# Altium schematic sheet 06-USB PORTS.SchDoc
size 513 x 386 mm
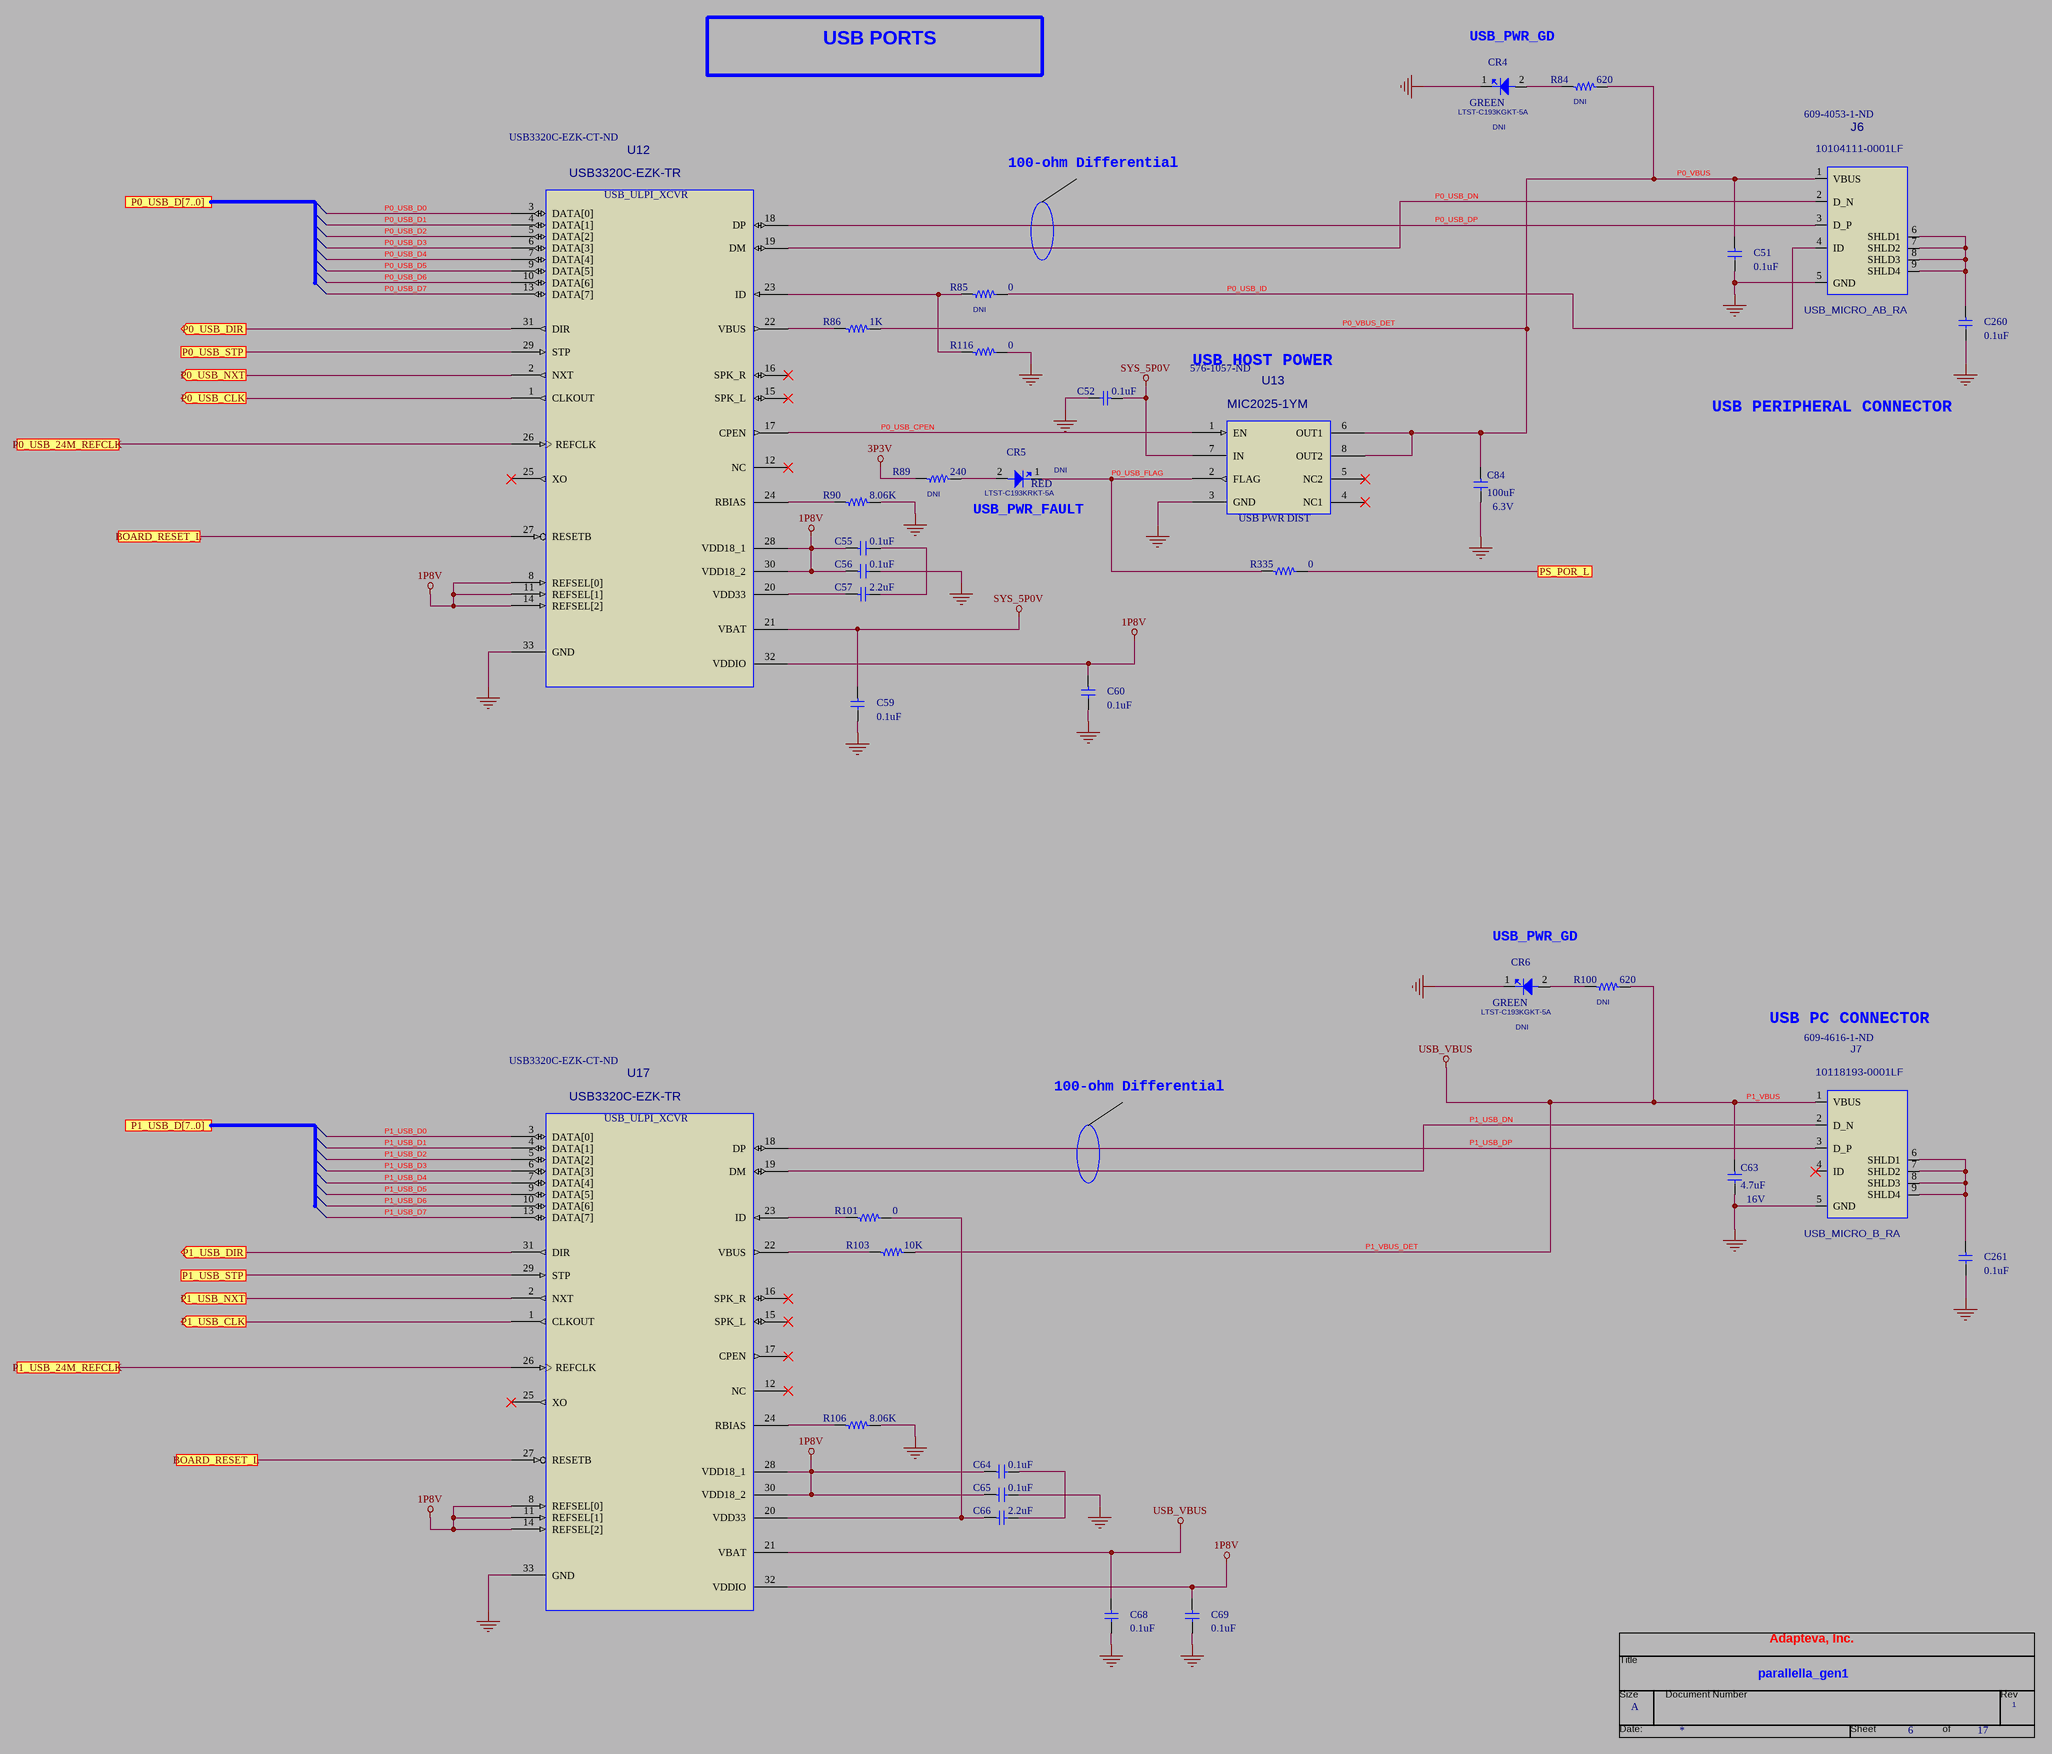
[diagram p0: 06-USB PORTS.SchDoc]

## Parts
*  RevCode: 1  Title: parallella_gen1  Page Size: A  Page Number: 6  Page Count: 17  OrgAddr1: Adapteva, Inc.  (hidden comment: TitleBlock0)  (graphical)
C51  0.1uF  [C0402]
C52  0.1uF  [C0402]
C55  0.1uF  [C0402]
C56  0.1uF  [C0402]
C57  2.2uF  [C0402]
C59  0.1uF  [C0402]
C60  0.1uF  [C0402]
C63  4.7uF  VOLTAGE: 16V  [C0603]
C64  0.1uF  [C0402]
C65  0.1uF  [C0402]
C66  2.2uF  [C0402]
C68  0.1uF  [C0402]
C69  0.1uF  [C0402]
C84  100uF  VOLTAGE: 6.3V  [C1210]
C260  0.1uF  [C0402]
C261  0.1uF  [C0402]
CR4  GREEN  Vendor PN: LTST-C193KGKT-5A  INSTALL: DNI  [LED_0603]
CR5  RED  Vendor PN: LTST-C193KRKT-5A  INSTALL: DNI  [LED_0603]
CR6  GREEN  Vendor PN: LTST-C193KGKT-5A  INSTALL: DNI  [LED_0603]
J6  USB_MICRO_AB_RA  MFG PART NO: 10104111-0001LF  Supplier Part Number 1: 609-4053-1-ND  [USB_MICRO5P_5X7X3P07MMH]
J7  USB_MICRO_B_RA  MFG PART NO: 10118193-0001LF  Supplier Part Number 1: 609-4616-1-ND  [USB_MICROB_5P05X7P86X3P1MM_RH]
R84  620  INSTALL: DNI  [R0402]
R85  0  INSTALL: DNI  [R0402]
R86  1K  [R0402]
R89  240  INSTALL: DNI  [R0402]
R90  8.06K  [R0402]
R100  620  INSTALL: DNI  [R0402]
R101  0  [R0402]
R103  10K  [R0402]
R106  8.06K  [R0402]
R116  0  [R0402]
R335  0  [R0402]
U12  USB_ULPI_XCVR  Vendor PN: USB3320C-EZK-TR  Supplier Part Number 1: USB3320C-EZK-CT-ND  [QFN32_5SQXP9H_P5MMP_3P45PAD]
U13  USB PWR DIST  Vendor PN: MIC2025-1YM  Supplier Part Number 1: 576-1057-ND  [SOIC8_33P94X4P93X1P63H_P65P]
U17  USB_ULPI_XCVR  Vendor PN: USB3320C-EZK-TR  Supplier Part Number 1: USB3320C-EZK-CT-ND  [QFN32_5SQXP9H_P5MMP_3P45PAD]

## Ports
BOARD_RESET_L, P0_USB_24M_REFCLK, P0_USB_CLK (out), P0_USB_D[7..0], P0_USB_DIR (out), P0_USB_NXT (out), P0_USB_STP, P1_USB_24M_REFCLK, P1_USB_CLK (out), P1_USB_D[7..0], P1_USB_DIR (out), P1_USB_NXT (out), P1_USB_STP, PS_POR_L

## Nets
1P8V: C55.1 C56.1 C60.1 C64.1 C65.1 C69.1 U12.8(REFSEL[0]) U12.11(REFSEL[1]) U12.14(REFSEL[2]) U12.28(VDD18_1) U12.30(VDD18_2) U12.32(VDDIO) U17.8(REFSEL[0]) U17.11(REFSEL[1]) U17.14(REFSEL[2]) U17.28(VDD18_1) U17.30(VDD18_2) U17.32(VDDIO)
3P3V: R89.1
GND: C51.2 C52.2 C56.2 C59.2 C60.2 C63.2 C65.2 C68.2 C69.2 C84.2 C260.2 C261.2 CR4.1(C) CR6.1(C) J6.5(GND) J7.5(GND) R90.2 R106.2 R116.2 U12.33(GND) U13.3(GND) U17.33(GND)
P1_VBUS: C63.1 C68.1 J7.1(VBUS) R100.2 R103.2 U17.21(VBAT)  [also labelled P1_VBUS_DET, USB_VBUS]
SYS_5P0V: C52.1 C59.1 U12.21(VBAT) U13.7(IN)
BOARD_RESET_L: U12.27(RESETB) U17.27(RESETB) ; port BOARD_RESET_L
P0_USB_24M_REFCLK: U12.26(REFCLK) ; port P0_USB_24M_REFCLK
P0_USB_CLK: U12.1(CLKOUT) ; port P0_USB_CLK
P0_USB_CPEN: U12.17(CPEN) U13.1(EN)
P0_USB_D0: U12.3(DATA[0])
P0_USB_D1: U12.4(DATA[1])
P0_USB_D2: U12.5(DATA[2])
P0_USB_D3: U12.6(DATA[3])
P0_USB_D4: U12.7(DATA[4])
P0_USB_D5: U12.9(DATA[5])
P0_USB_D6: U12.10(DATA[6])
P0_USB_D7: U12.13(DATA[7])
P0_USB_DIR: U12.31(DIR) ; port P0_USB_DIR
P0_USB_DN: J6.2(D_N) U12.19(DM)
P0_USB_DP: J6.3(D_P) U12.18(DP)
P0_USB_FLAG: CR5.1(C) R335.1 U13.2(FLAG)
P0_USB_ID: J6.4(ID) R85.2
P0_USB_NXT: U12.2(NXT) ; port P0_USB_NXT
P0_USB_STP: U12.29(STP) ; port P0_USB_STP
P0_VBUS: C51.1 C84.1 J6.1(VBUS) R84.2 R86.2 U13.6(OUT1) U13.8(OUT2)  [also labelled P0_VBUS_DET]
P1_USB_24M_REFCLK: U17.26(REFCLK) ; port P1_USB_24M_REFCLK
P1_USB_CLK: U17.1(CLKOUT) ; port P1_USB_CLK
P1_USB_D0: U17.3(DATA[0])
P1_USB_D1: U17.4(DATA[1])
P1_USB_D2: U17.5(DATA[2])
P1_USB_D3: U17.6(DATA[3])
P1_USB_D4: U17.7(DATA[4])
P1_USB_D5: U17.9(DATA[5])
P1_USB_D6: U17.10(DATA[6])
P1_USB_D7: U17.13(DATA[7])
P1_USB_DIR: U17.31(DIR) ; port P1_USB_DIR
P1_USB_DN: J7.2(D_N) U17.19(DM)
P1_USB_DP: J7.3(D_P) U17.18(DP)
P1_USB_NXT: U17.2(NXT) ; port P1_USB_NXT
P1_USB_STP: U17.29(STP) ; port P1_USB_STP
PS_POR_L: R335.2 ; port PS_POR_L
NetC55_2: C55.2 C57.2
NetC57_1: C57.1 U12.20(VDD33)
NetC64_2: C64.2 C66.2
NetC66_1: C66.1 R101.2 U17.20(VDD33)
NetC260_1: C260.1 J6.6(SHLD1) J6.7(SHLD2) J6.8(SHLD3) J6.9(SHLD4)
NetC261_1: C261.1 J7.6(SHLD1) J7.7(SHLD2) J7.8(SHLD3) J7.9(SHLD4)
NetCR4_2: CR4.2(A) R84.1
NetCR5_2: CR5.2(A) R89.2
NetCR6_2: CR6.2(A) R100.1
NetR85_1: R85.1 R116.1 U12.23(ID)
NetR86_1: R86.1 U12.22(VBUS)
NetR90_1: R90.1 U12.24(RBIAS)
NetR101_1: R101.1 U17.23(ID)
NetR103_1: R103.1 U17.22(VBUS)
NetR106_1: R106.1 U17.24(RBIAS)

Not connected (* = marked no-connect by the designer): J7 4(ID)*; U12 12(NC)* 15(SPK_L)* 16(SPK_R)* 25(XO)*; U13 4(NC1)* 5(NC2)*; U17 12(NC)* 15(SPK_L)* 16(SPK_R)* 17(CPEN)* 25(XO)*

## Notes on the sheet
- USB_PWR_GD
- USB PORTS
- 100-ohm Differential
- USB HOST POWER
- USB PERIPHERAL CONNECTOR
- USB_PWR_FAULT
- USB PC CONNECTOR
- (in symbol TitleBlock0) Title; Size; Document Number; Rev; Date:; Sheet; of

## Library data of the parts
C51 C52 C55 C56 C59 C60 C64 C65 C68 C69 C260 C261 = CAP0402_0P1UF_X5R_35V: CAP, 0402, 0.1UF, X5R, 35V; ALT_SYMBOLS: C0402_BGA; Vendor PN: GMK105BJ104KV-F; Vendor: TAIYO YUDEN; DEVICE: CAP0402_0P1UF_X5R_35V; MFG PART NO: GMK105BJ104KV-F; MFG: TAIYO YUDEN; PCB Footprint: C0402
C57 C66 = CAP0402_2P2UF_X5R: CAP, 0402, 2.2UF, X5R, 6.3V; MFG PART NO: C1005X5R0J225M; MFG: TDK; ALT_SYMBOLS: C0402_BGA; DEVICE: CAP0402_2P2UF_X5R; Vendor: TDK; Vendor PN: C1005X5R0J225M; PCB Footprint: C0402
C63 = CAP0603_4P7UF_16V_X5R: CAP, 0603, 4.7UF, X5R, 16V; MFG PART NO: C1608X5R1C475K080AC; MFG: TDK; DEVICE: CAP0603_4P7UF_16V_X5R; Vendor: TDK; Vendor PN: C1608X5R1C475K080AC; PCB Footprint: C0603
C84 = CAP1210_100UF_X5R_LOESR: CAP, 1210, 100UF, X5R, 6.3V, LOW ESR; MFG PART NO: GRM32ER60J107ME20L; MFG: MURATA; DEVICE: CAP1210_100UF_X5R_LOESR; Vendor: MURATA; Vendor PN: GRM32ER60J107ME20L; PCB Footprint: C1210
CR4 CR6 = LED_0603_5MA_GRN: LED, 0603, 5MA, SMT, GREEN; Voltage: 2V; MFG: LITE-ON INC; MFG PART NO: LTST-C193KGKT-5A; Vendor: LITE-ON INC; PCB Footprint: LED_0603
CR5 = LED_0603_5MA_RED: LED, 0603, 5MA, SMT, RED; Voltage: 2V; MFG: LITE-ON INC; MFG PART NO: LTST-C193KRKT-5A; Vendor: LITE-ON INC; PCB Footprint: LED_0603
J6 = USB_MICRO_AB_RA_SMT: CONN, USB, RCPT, MICRO AB, RA, SMT; MFG: FCI; DEVICE: USB_MICRO_AB_RA_SMT; Vendor: FCI; Vendor PN: 10104111-0001LF; PCB Footprint: USB_MICRO5P_5X7X3P07MMH; Supplier 1: Digi-Key
J7 = USB_MICRO_B_RA_SMT: CONN, USB, RCPT, MICRO B, RA, SMT; MFG: FCI; PCB Footprint: USB_MICROB_5P05X7P86X3P1MMH_R; DEVICE: USB_MICRO_B_RA_SMT; Vendor: FCI; Vendor PN: 10118193-0001LF; Supplier 1: Digi-Key
R84 R100 = RES0402_620: RES, 0402, 620, 1%; MFG PART NO: CRCW0402620RFKED; ALT_SYMBOLS: R0402_BGA; MFG: VISHAY; Vendor: VISHAY/DALE; DEVICE: RES0402_620; Vendor PN: CRCW0402620RFKED; PCB Footprint: R0402
R85 R101 R116 R335 = RES0402_0: RES, 0402, 0 OHM, 1%; MFG PART NO: CRCW04020000Z0ED; ALT_SYMBOLS: R0402_BGA; MFG: VISHAY; Vendor: VISHAY/DALE; DEVICE: RES0402_0; Vendor PN: CRCW04020000Z0ED; PCB Footprint: R0402
R86 = RES0402_1K: RES, 0402, 1K; MFG PART NO: CRCW04021K00FKED; ALT_SYMBOLS: R0402_BGA; MFG: VISHAY; Vendor: VISHAY/DALE; DEVICE: RES0402_1K; Vendor PN: CRCW04021K00FKED; PCB Footprint: R0402
R89 = RES0402_240: RES, 0402, 240, 1%; MFG PART NO: CRCW0402240RFKED; ALT_SYMBOLS: R0402_BGA; MFG: VISHAY; Vendor: VISHAY/DALE; DEVICE: RES0402_240; Vendor PN: CRCW0402240RFKED; PCB Footprint: R0402
R90 R106 = RES0402_8K06: RES, 0402, 8.06K; MFG PART NO: CRCW04028K06FKED; ALT_SYMBOLS: R0402_BGA; MFG: VISHAY; Vendor: VISHAY/DALE; DEVICE: RES0402_8K06; Vendor PN: CRCW04028K06FKED; PCB Footprint: R0402
R103 = RES0402_10K: RES, 0402, 10K; MFG PART NO: CRCW040210K0FKED; ALT_SYMBOLS: R0402_BGA; MFG: VISHAY; Vendor: VISHAY/DALE; DEVICE: RES0402_10K; Vendor PN: CRCW040210K0FKED; PCB Footprint: R0402
U12 U17 = USB3320_ULPI_XCVR: IC, USB ULPI XCVR, SINGLE SUPPLY, QFN32; Vendor: SMSC; DEVICE: USB3320_ULPI_XCVR; Supplier 1: Digi-Key
U13 = MIC2025_1_USB_SW: IC, USB DISTRIBUTION SW, 1 CH, SOIC8; Vendor: MICREL; DEVICE: MIC2025_1_USB_SW; PCB Footprint: SOIC8_33P94X4P93X1P63H_P65P; Supplier 1: Digi-Key
* = TitleBlock0: Page Create Date: March  8, 1995; Page Modify Date: *